# EAGLE schematic smartwatch-bottom (EAGLE 9.6.2)
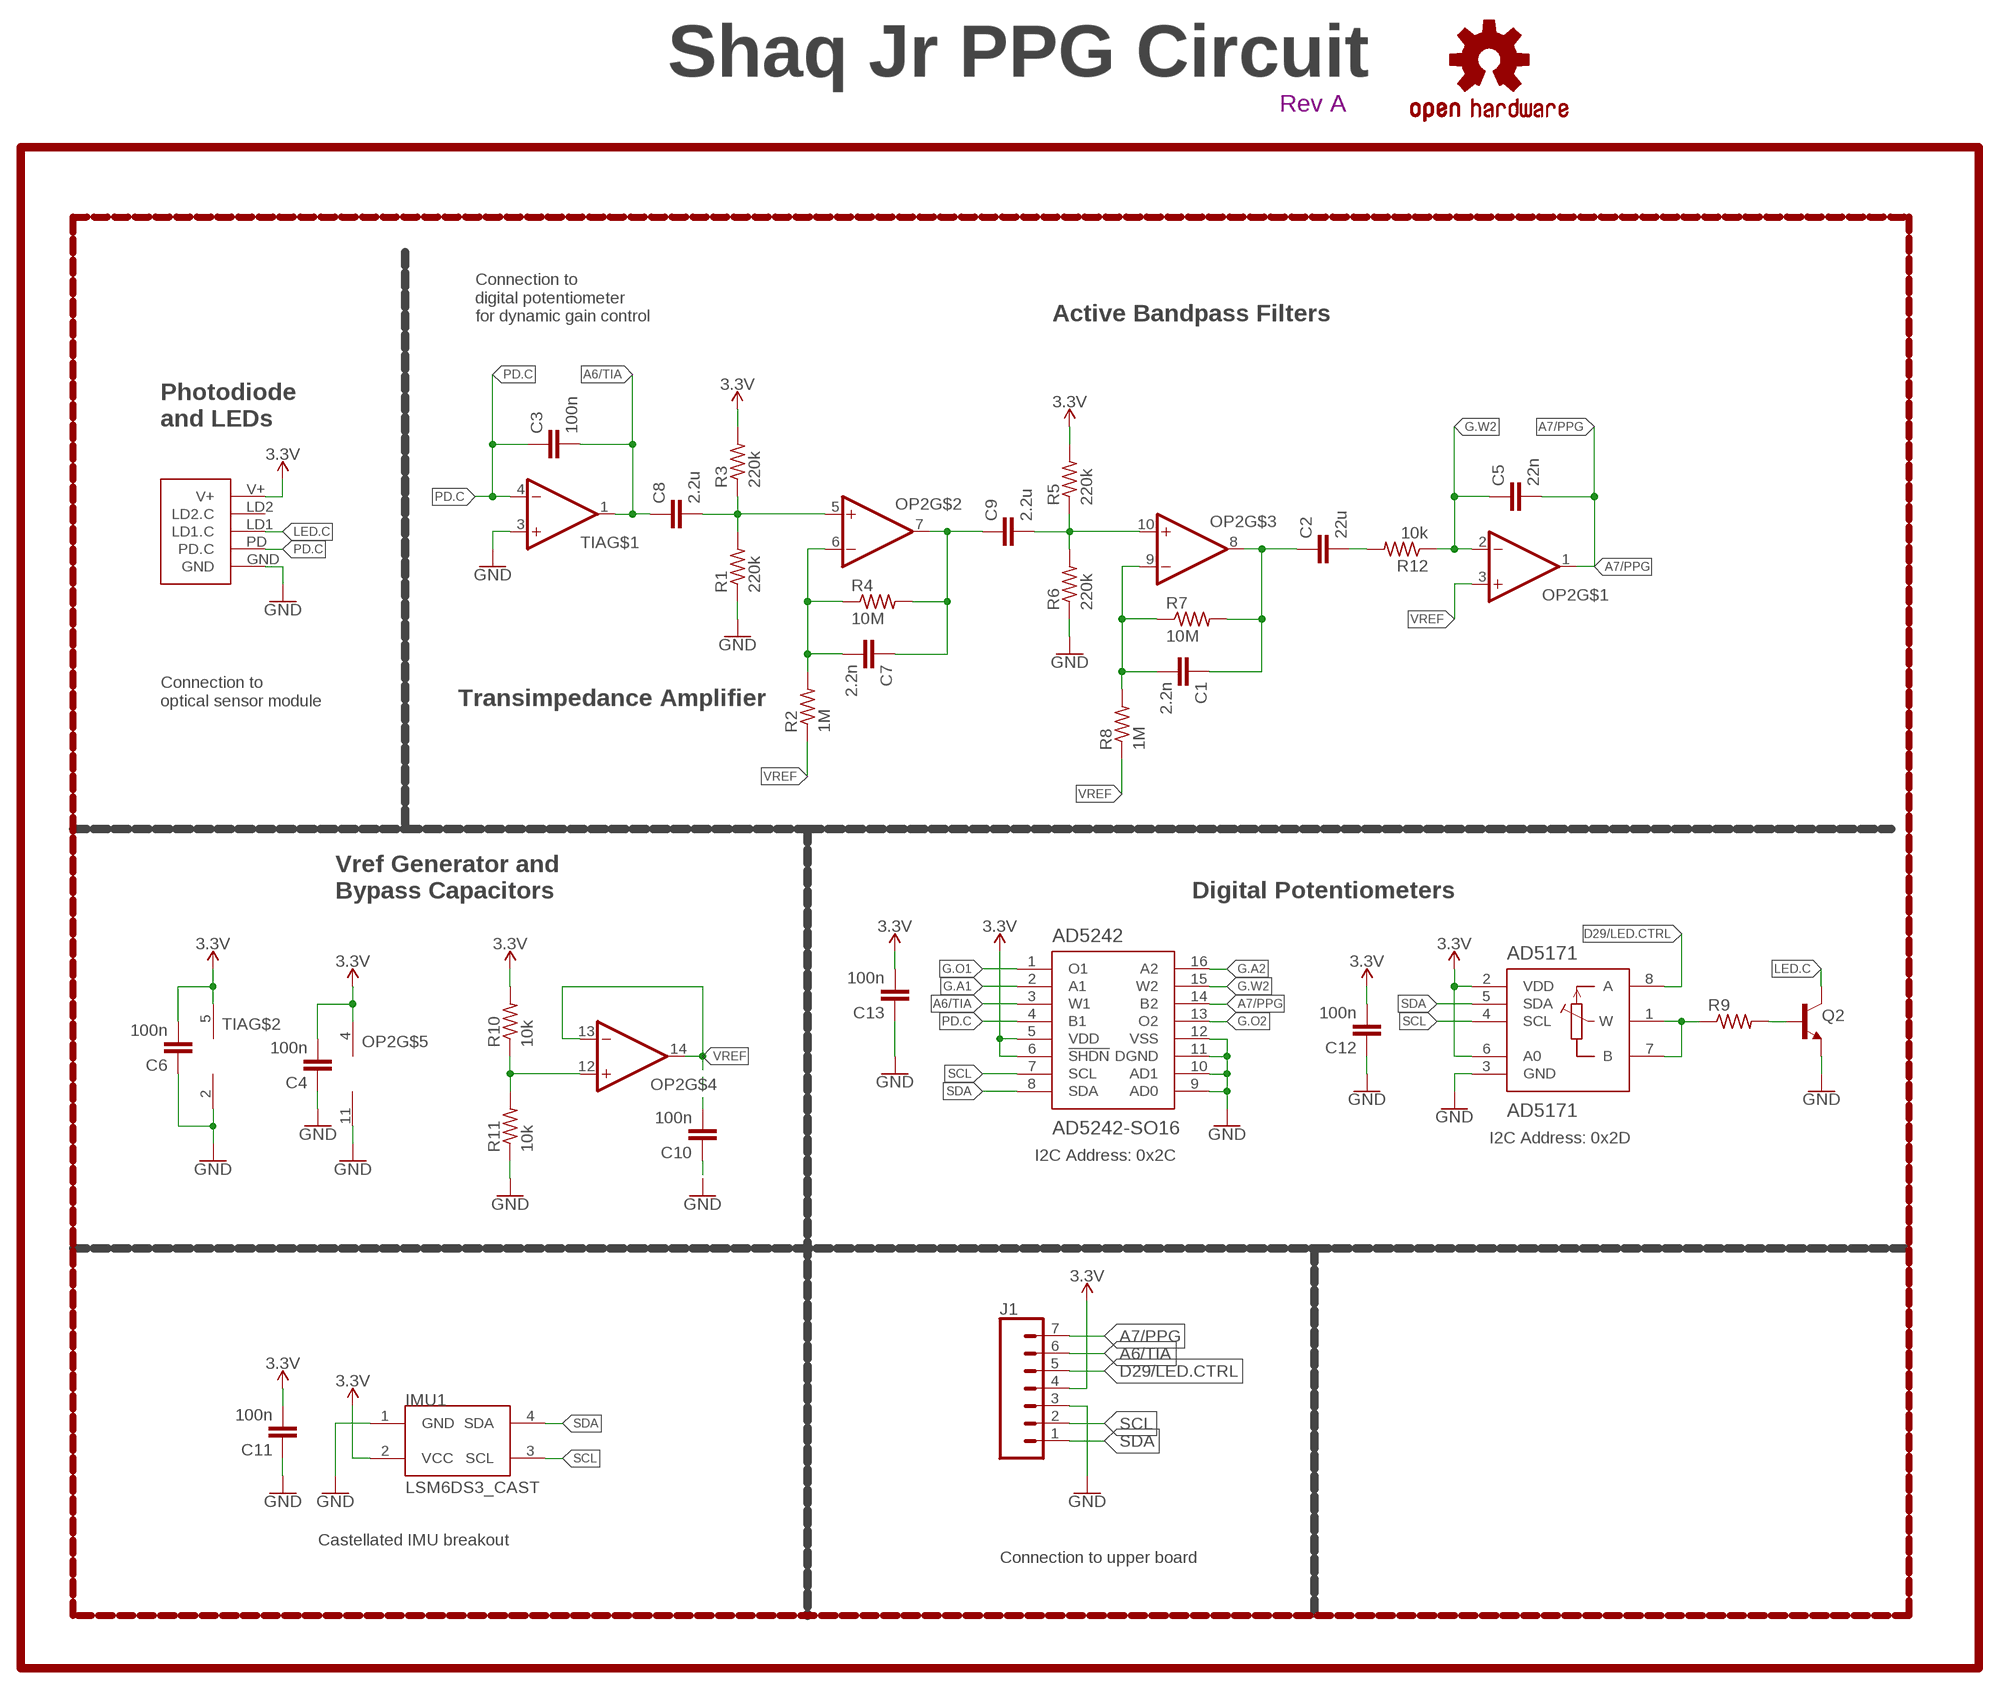
[diagram p0: schematic, sheet 1]

## Parts
AD5171  AD5171  [SOT-23-8]
AD5242  AD5242-SO16  [SO16]
C1  2.2n  CAPACITOR0603  [C0603]
C2  22u  CAPACITOR0603  [C0603]
C3  100n  CAPACITOR0603  [C0603]
C4  100n  CAPACITOR0603  [C0603]
C5  22n  CAPACITOR0603  [C0603]
C6  100n  CAPACITOR0603  [C0603]
C7  2.2n  CAPACITOR0603  [C0603]
C8  2.2u  CAPACITOR0603  [C0603]
C9  2.2u  CAPACITOR0603  [C0603]
C10  100n  CAPACITOR0603  [C0603]
C11  100n  CAPACITOR0603  [C0603]
C12  100n  CAPACITOR0603  [C0603]
C13  100n  CAPACITOR0603  [C0603]
IMU1  LSM6DS3_CAST  [LSM6DS3_CAST]
J1  CONN_07-1.27MM  [1X07_1.27MM]
LOGO1  REVISION.A  [REV.A]
LOGO2  OSHW-LOGOS  [OSHW-LOGO-S]
OP2  OP-QUAD-SO14  [SO14]
Q2  NPN-GENERIC  [SOT23-3]
R1  220k  RESISTOR0603  [R0603]
R2  1M  RESISTOR0603  [R0603]
R3  220k  RESISTOR0603  [R0603]
R4  10M  RESISTOR0603  [R0603]
R5  220k  RESISTOR0603  [R0603]
R6  220k  RESISTOR0603  [R0603]
R7  10M  RESISTOR0603  [R0603]
R8  1M  RESISTOR0603  [R0603]
R9  RESISTOR0603  [R0603]
R10  10k  RESISTOR0402  [R0402]
R11  10k  RESISTOR0402  [R0402]
R12  10k  RESISTOR0603  [R0603]
TIA  OP-SINGLEOT  [SOT23-5]
U$1  PPG.MODULE.2  [PPG.MODULE.2]

## Nets
3.3V: AD5171.2(VDD) AD5171.6(A0) AD5242.5(VDD) AD5242.6(!SHDN) C4.2 C6.2 C11.2 C12.2 C13.2 IMU1.2(VCC) J1.4 OP2.4(V+) R3.2 R5.2 R10.2 TIA.5(V+) U$1.V+
A6/TIA: AD5242.3(W1) C3.2 C8.1 J1.6 TIA.1(OUT)
A7/PPG: AD5242.14(B2) C5.2 J1.7 OP2.1(OUT)
D29/LED.CTRL: AD5171.8(A) J1.5
G.A1: AD5242.2(A1)
G.A2: AD5242.16(A2)
G.O1: AD5242.1(O1)
G.O2: AD5242.13(O2)
G.W2: AD5242.15(W2) C5.1 OP2.2(-IN) R12.1
GND: AD5171.3(GND) AD5242.9(AD0) AD5242.10(AD1) AD5242.11(DGND) AD5242.12(VSS) C4.1 C6.1 C10.1 C11.1 C12.1 C13.1 IMU1.1(GND) J1.3 OP2.11(V-) Q2.2(E) R1.1 R6.1 R11.1 TIA.2(V-) TIA.3(+IN) U$1.GND
LED.C: Q2.3(C) U$1.LD1(LD1.C)
N$1: C8.2 OP2.5(+IN) R1.2 R3.1
N$2: C9.2 OP2.10(+IN) R5.1 R6.2
N$3: C7.2 OP2.6(-IN) R2.2 R4.1
N$4: C7.1 C9.1 OP2.7(OUT) R4.2
N$5: C1.2 OP2.9(-IN) R7.1 R8.2
N$6: C1.1 C2.1 OP2.8(OUT) R7.2
N$7: C2.2 R12.2
N$11: Q2.1(B) R9.2
N$12: AD5171.1(W) AD5171.7(B) R9.1
N$14: OP2.12(+IN) R10.1 R11.2
PD.C: AD5242.4(B1) C3.1 TIA.4(-IN) U$1.PD(PD.C)
SCL: AD5171.4(SCL) AD5242.7(SCL) IMU1.3(SCL) J1.2
SDA: AD5171.5(SDA) AD5242.8(SDA) IMU1.4(SDA) J1.1
VREF: C10.2 OP2.3(+IN) OP2.13(-IN) OP2.14(OUT) R2.1 R8.1
Unconnected: U$1.LD2(LD2.C)

## Notes on the sheet
- Shaq Jr PPG Circuit
- Connection to
  digital potentiometer
  for dynamic gain control
- Active Bandpass Filters
- Photodiode
  and LEDs
- Connection to
  optical sensor module
- Transimpedance Amplifier
- Vref Generator and 
  Bypass Capacitors
- Digital Potentiometers
- I2C Address: 0x2D
- I2C Address: 0x2C
- Castellated IMU breakout
- Connection to upper board

## Library data of the parts
AD5171 = LinnesLab-DigitalIC:AD5171
AD5242 = LinnesLab-DigitalIC:AD5242
C1-C13 = LinnesLab-Passives:CAPACITOR
IMU1 = LinnesLab-Sensors:LSM6DS3_CAST
J1 = LinnesLab-Connectors:CONN_07: Multi connection point. Often used as Generic Header-pin footprint for 0.1 inch spaced/style header connections On any of the 0.1 inch spaced packages, you can populate with these: Break Away Headers - Straight <https://www.sparkfun.com/products/116> (PRT-00116) Break Away Male Headers - Right Angle <https://www.sparkfun.com/products/553> (PRT-00553) Female Headers <https://www.sparkfun.com/products/115> (PRT-00115) Break Away Headers - Machine Pin <https://www.sparkfun.com/products/117> (PRT-00117) Break Away Female Headers - Swiss Machine Pin <https://www.sparkfun.com/products/743> (PRT-00743) For SCREWTERMINALS and SPRING TERMINALS visit here: Screw Terimnals on SparkFun.com <https://www.sparkfun.com/search/results?term=Screw+Terminals> (5mm/3.5mm/2.54mm spacing) This device is also useful as a general connection point to wire up your design to another part of your project. Our various solder wires solder well into these plated through hole pads. Hook-Up Wire - Assortment (Stranded, 22 AWG) <https://www.sparkfun.com/products/11375> (PRT-11375) Hook-Up Wire - Assortment (Solid Core, 22 AWG) <https://www.sparkfun.com/products/11367> (PRT-11367) View the entire wire category on our website here <https://www.sparkfun.com/categories/141> Special notes: Molex polarized connector foot print use with SKU : PRT-08231 with associated crimp pins and housings. 1MM SMD Version SKU: PRT-10208 NOTES ON THE VARIANTS LOCK and LOCK_LONGPADS... This footprint was designed to help hold the alignment of a through-hole component (i.e. 6-pin header) while soldering it into place. You may notice that each hole has been shifted either up or down by 0.005 of an inch from it's more standard position (which is a perfectly straight line). This slight alteration caused the pins (the squares in the middle) to touch the edges of the holes. Because they are alternating, it causes a "brace" to hold the component in place. 0.005 has proven to be the perfect amount of "off-center" position when using our standard breakaway headers. Although looks a little odd when you look at the bare footprint, once you have a header in there, the alteration is very hard to notice. Also,if you push a header all the way into place, it is covered up entirely on the bottom side.
LOGO1 = LinnesLab-Logos:REVISION.A
LOGO2 = LinnesLab-Logos:OSHW-LOGO: Open-Source Hardware (OSHW) Logo This logo indicates the piece of hardware it is found on incorporates a OSHW license and/or adheres to the definition of open source hardware found here: http://freedomdefined.org/OSHW
OP2 = LinnesLab-AnalogIC:OP-QUAD: General symbol and footprints for Quad Op Amps. Use with any standard general purpose op amp.
Q2 = LinnesLab-DiscreteSemi:NPN
R1-R12 = LinnesLab-Passives:RESISTOR
TIA = LinnesLab-AnalogIC:OP-SINGLE: Single Op Amp 2.7V to 6.0V Single Supply CMOS Source: http://ww1.microchip.com/downloads/en/DeviceDoc/21314g.pdf
U$1 = LinnesLab-Connectors:PPG.MODULE.2: Digi-Key Part Number: S9014E-50-ND Manufacturer Part Number: GRPB501VWVN-RC Description: 1mm insulation height 0.05in pitch 50 positions